# EasyEDA Pro project NAND-7S.eprj, schematic Schematic1
Board Name: Board1; Create Date: 2026-02-24; Page Name: P1; Project Name: NAND-7S; Schematic Name: Schematic1; Update Date: 2026-03-22; Company: 嘉立创EDA; Page Size: A4; Version: V1.0
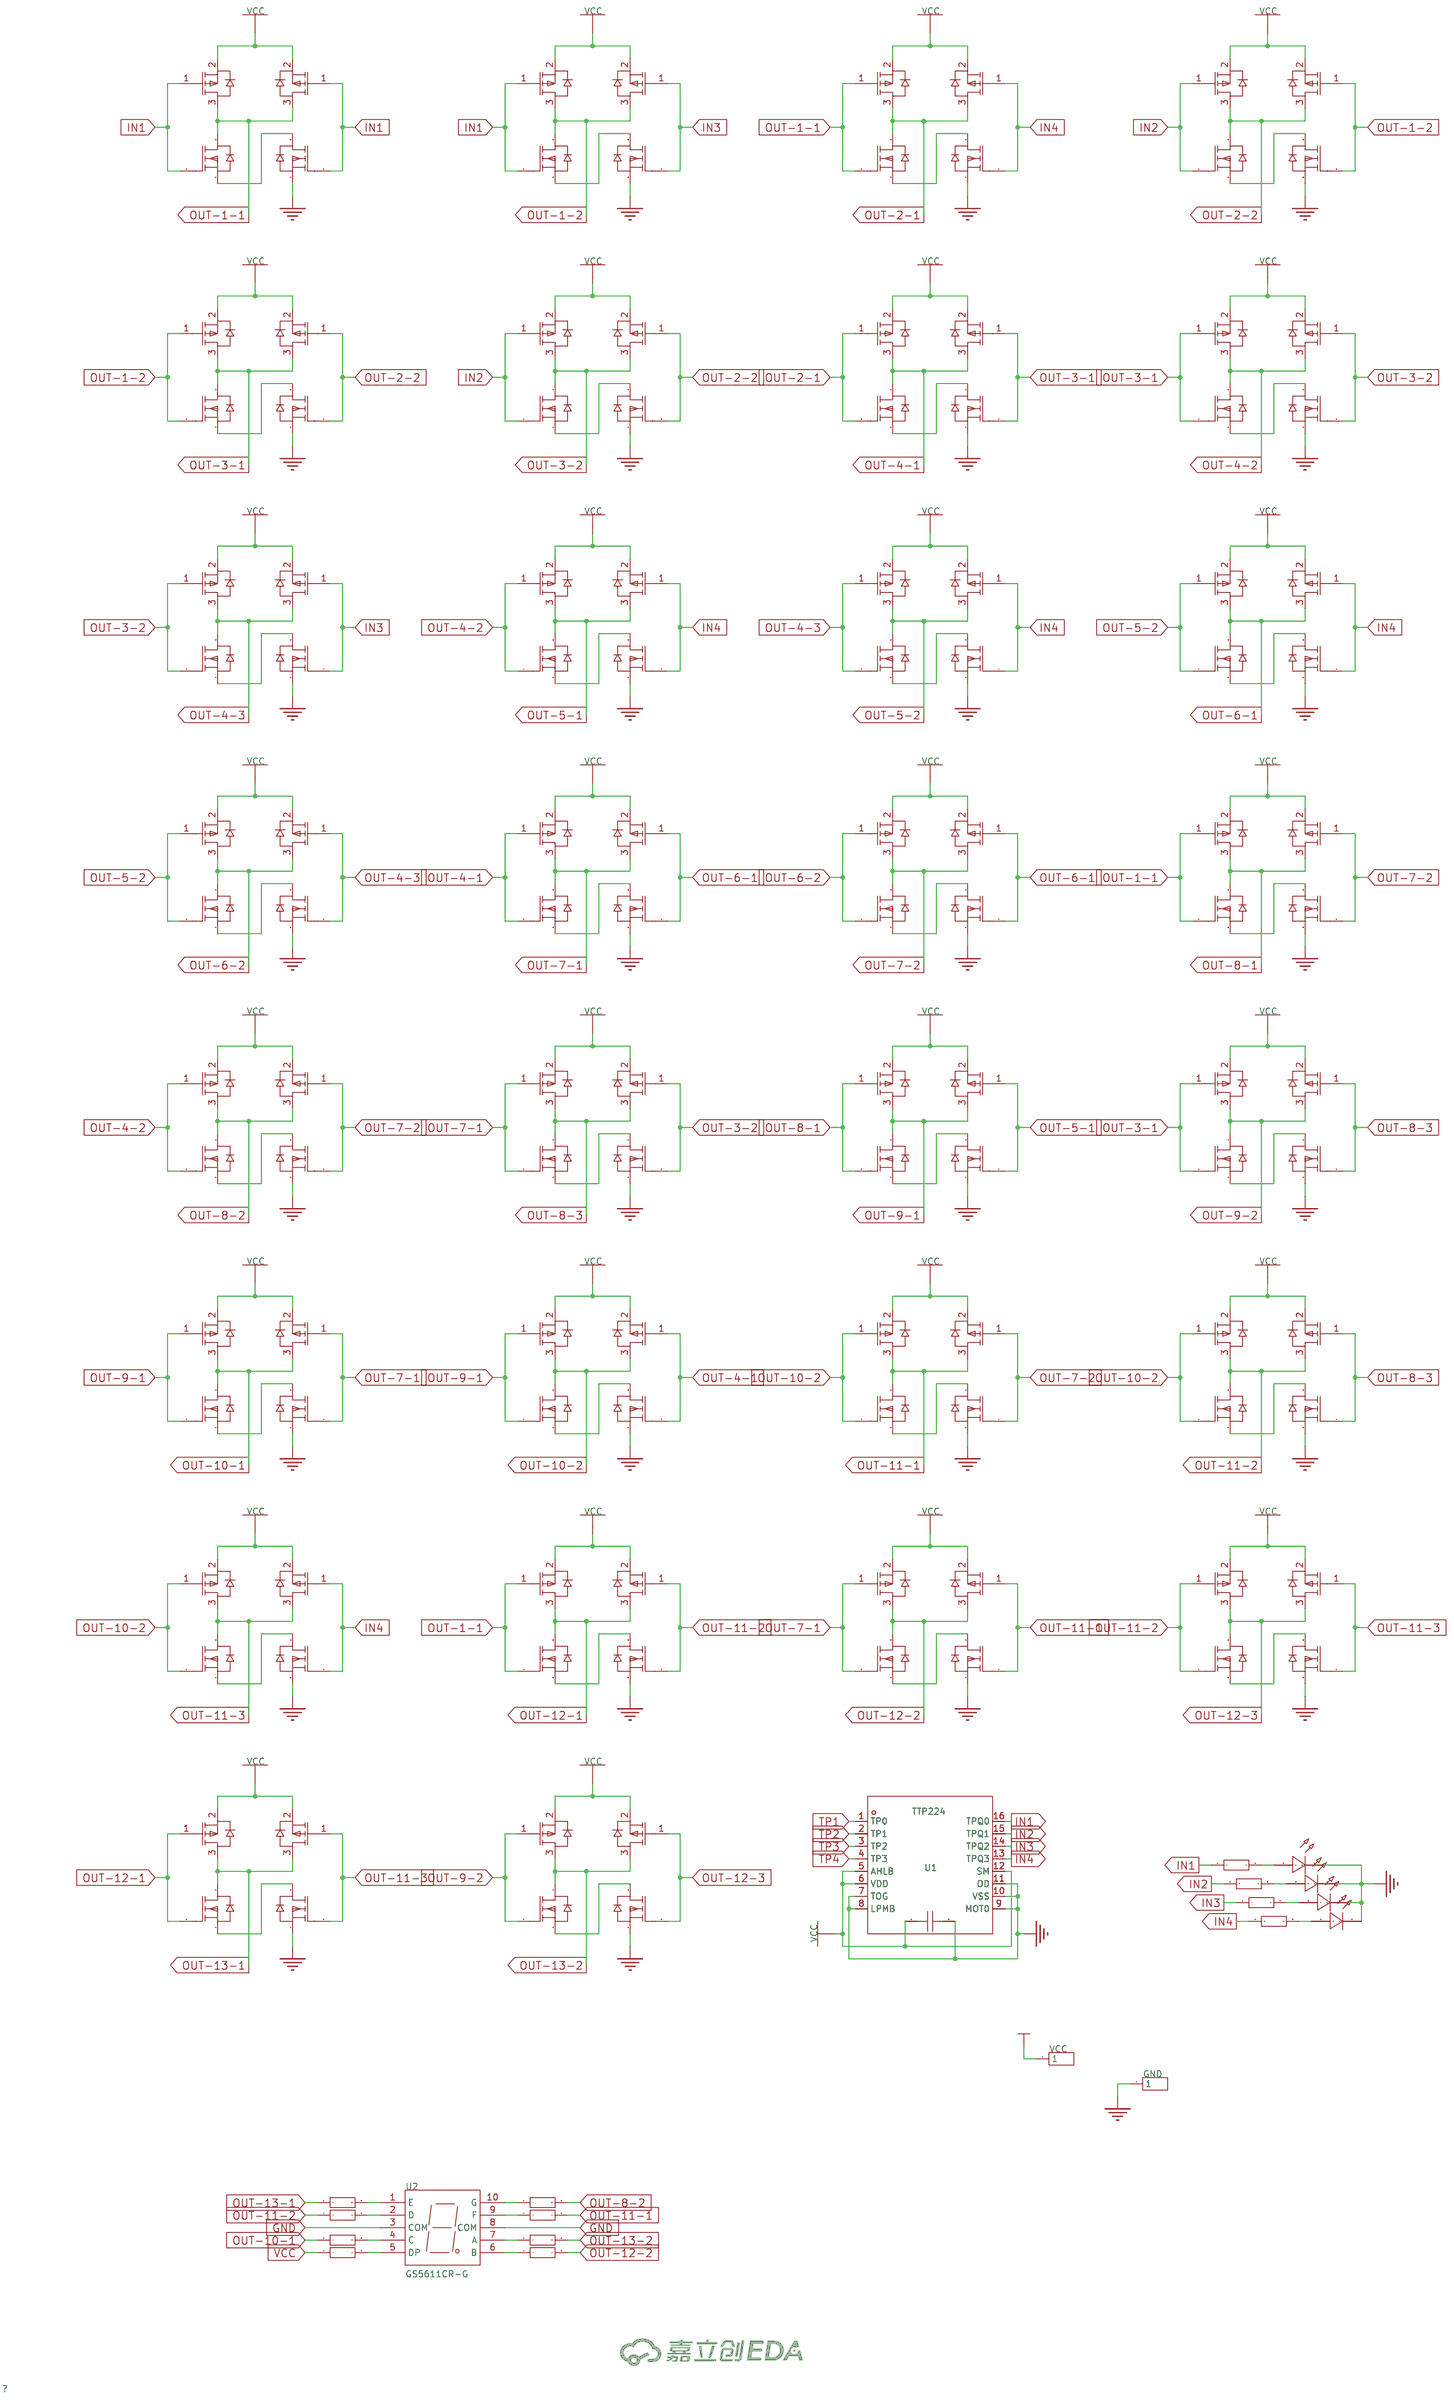
[diagram p0: schematic sheet]

## Parts
C1  100nF  [C0603]
GND  GND  [HDR-TH_1P-V-M_XKB_X4611WV-01I-C28D40]
LED1  -  [LED_0603]
LED2  -  [LED_0603]
LED3  -  [LED_0603]
LED4  -  [LED_0603]
N1-1  CJ2304  [SOT-23-3_L2.9-W1.3-P1.90-LS2.4-BR]
N1-2  CJ2304  [SOT-23-3_L2.9-W1.3-P1.90-LS2.4-BR]
N2-1  CJ2304  [SOT-23-3_L2.9-W1.3-P1.90-LS2.4-BR]
N2-2  CJ2304  [SOT-23-3_L2.9-W1.3-P1.90-LS2.4-BR]
N3-1  CJ2304  [SOT-23-3_L2.9-W1.3-P1.90-LS2.4-BR]
N3-2  CJ2304  [SOT-23-3_L2.9-W1.3-P1.90-LS2.4-BR]
N4-1  CJ2304  [SOT-23-3_L2.9-W1.3-P1.90-LS2.4-BR]
N4-2  CJ2304  [SOT-23-3_L2.9-W1.3-P1.90-LS2.4-BR]
N5-1  CJ2304  [SOT-23-3_L2.9-W1.3-P1.90-LS2.4-BR]
N5-2  CJ2304  [SOT-23-3_L2.9-W1.3-P1.90-LS2.4-BR]
N6-1  CJ2304  [SOT-23-3_L2.9-W1.3-P1.90-LS2.4-BR]
N6-2  CJ2304  [SOT-23-3_L2.9-W1.3-P1.90-LS2.4-BR]
N7-1  CJ2304  [SOT-23-3_L2.9-W1.3-P1.90-LS2.4-BR]
N7-2  CJ2304  [SOT-23-3_L2.9-W1.3-P1.90-LS2.4-BR]
N8-1  CJ2304  [SOT-23-3_L2.9-W1.3-P1.90-LS2.4-BR]
N8-2  CJ2304  [SOT-23-3_L2.9-W1.3-P1.90-LS2.4-BR]
N9-1  CJ2304  [SOT-23-3_L2.9-W1.3-P1.90-LS2.4-BR]
N9-2  CJ2304  [SOT-23-3_L2.9-W1.3-P1.90-LS2.4-BR]
N10-1  CJ2304  [SOT-23-3_L2.9-W1.3-P1.90-LS2.4-BR]
N10-2  CJ2304  [SOT-23-3_L2.9-W1.3-P1.90-LS2.4-BR]
N11-1  CJ2304  [SOT-23-3_L2.9-W1.3-P1.90-LS2.4-BR]
N11-2  CJ2304  [SOT-23-3_L2.9-W1.3-P1.90-LS2.4-BR]
N12-1  CJ2304  [SOT-23-3_L2.9-W1.3-P1.90-LS2.4-BR]
N12-2  CJ2304  [SOT-23-3_L2.9-W1.3-P1.90-LS2.4-BR]
N13-1  CJ2304  [SOT-23-3_L2.9-W1.3-P1.90-LS2.4-BR]
N13-2  CJ2304  [SOT-23-3_L2.9-W1.3-P1.90-LS2.4-BR]
N14-1  CJ2304  [SOT-23-3_L2.9-W1.3-P1.90-LS2.4-BR]
N14-2  CJ2304  [SOT-23-3_L2.9-W1.3-P1.90-LS2.4-BR]
N15-1  CJ2304  [SOT-23-3_L2.9-W1.3-P1.90-LS2.4-BR]
N15-2  CJ2304  [SOT-23-3_L2.9-W1.3-P1.90-LS2.4-BR]
N16-1  CJ2304  [SOT-23-3_L2.9-W1.3-P1.90-LS2.4-BR]
N16-2  CJ2304  [SOT-23-3_L2.9-W1.3-P1.90-LS2.4-BR]
N17-1  CJ2304  [SOT-23-3_L2.9-W1.3-P1.90-LS2.4-BR]
N17-2  CJ2304  [SOT-23-3_L2.9-W1.3-P1.90-LS2.4-BR]
N18-1  CJ2304  [SOT-23-3_L2.9-W1.3-P1.90-LS2.4-BR]
N18-2  CJ2304  [SOT-23-3_L2.9-W1.3-P1.90-LS2.4-BR]
N19-1  CJ2304  [SOT-23-3_L2.9-W1.3-P1.90-LS2.4-BR]
N19-2  CJ2304  [SOT-23-3_L2.9-W1.3-P1.90-LS2.4-BR]
N20-1  CJ2304  [SOT-23-3_L2.9-W1.3-P1.90-LS2.4-BR]
N20-2  CJ2304  [SOT-23-3_L2.9-W1.3-P1.90-LS2.4-BR]
N21-1  CJ2304  [SOT-23-3_L2.9-W1.3-P1.90-LS2.4-BR]
N21-2  CJ2304  [SOT-23-3_L2.9-W1.3-P1.90-LS2.4-BR]
N22-1  CJ2304  [SOT-23-3_L2.9-W1.3-P1.90-LS2.4-BR]
N22-2  CJ2304  [SOT-23-3_L2.9-W1.3-P1.90-LS2.4-BR]
N23-1  CJ2304  [SOT-23-3_L2.9-W1.3-P1.90-LS2.4-BR]
N23-2  CJ2304  [SOT-23-3_L2.9-W1.3-P1.90-LS2.4-BR]
N24-1  CJ2304  [SOT-23-3_L2.9-W1.3-P1.90-LS2.4-BR]
N24-2  CJ2304  [SOT-23-3_L2.9-W1.3-P1.90-LS2.4-BR]
N25-1  CJ2304  [SOT-23-3_L2.9-W1.3-P1.90-LS2.4-BR]
N25-2  CJ2304  [SOT-23-3_L2.9-W1.3-P1.90-LS2.4-BR]
N26-1  CJ2304  [SOT-23-3_L2.9-W1.3-P1.90-LS2.4-BR]
N26-2  CJ2304  [SOT-23-3_L2.9-W1.3-P1.90-LS2.4-BR]
N27-1  CJ2304  [SOT-23-3_L2.9-W1.3-P1.90-LS2.4-BR]
N27-2  CJ2304  [SOT-23-3_L2.9-W1.3-P1.90-LS2.4-BR]
N28-1  CJ2304  [SOT-23-3_L2.9-W1.3-P1.90-LS2.4-BR]
N28-2  CJ2304  [SOT-23-3_L2.9-W1.3-P1.90-LS2.4-BR]
N29-1  CJ2304  [SOT-23-3_L2.9-W1.3-P1.90-LS2.4-BR]
N29-2  CJ2304  [SOT-23-3_L2.9-W1.3-P1.90-LS2.4-BR]
N30-1  CJ2304  [SOT-23-3_L2.9-W1.3-P1.90-LS2.4-BR]
N30-2  CJ2304  [SOT-23-3_L2.9-W1.3-P1.90-LS2.4-BR]
P1-1  LP2301LT1G  [SOT-23-3_L2.9-W1.3-P1.90-LS2.4-BR]
P1-2  LP2301LT1G  [SOT-23-3_L2.9-W1.3-P1.90-LS2.4-BR]
P2-1  LP2301LT1G  [SOT-23-3_L2.9-W1.3-P1.90-LS2.4-BR]
P2-2  LP2301LT1G  [SOT-23-3_L2.9-W1.3-P1.90-LS2.4-BR]
P3-1  LP2301LT1G  [SOT-23-3_L2.9-W1.3-P1.90-LS2.4-BR]
P3-2  LP2301LT1G  [SOT-23-3_L2.9-W1.3-P1.90-LS2.4-BR]
P4-1  LP2301LT1G  [SOT-23-3_L2.9-W1.3-P1.90-LS2.4-BR]
P4-2  LP2301LT1G  [SOT-23-3_L2.9-W1.3-P1.90-LS2.4-BR]
P5-1  LP2301LT1G  [SOT-23-3_L2.9-W1.3-P1.90-LS2.4-BR]
P5-2  LP2301LT1G  [SOT-23-3_L2.9-W1.3-P1.90-LS2.4-BR]
P6-1  LP2301LT1G  [SOT-23-3_L2.9-W1.3-P1.90-LS2.4-BR]
P6-2  LP2301LT1G  [SOT-23-3_L2.9-W1.3-P1.90-LS2.4-BR]
P7-1  LP2301LT1G  [SOT-23-3_L2.9-W1.3-P1.90-LS2.4-BR]
P7-2  LP2301LT1G  [SOT-23-3_L2.9-W1.3-P1.90-LS2.4-BR]
P8-1  LP2301LT1G  [SOT-23-3_L2.9-W1.3-P1.90-LS2.4-BR]
P8-2  LP2301LT1G  [SOT-23-3_L2.9-W1.3-P1.90-LS2.4-BR]
P9-1  LP2301LT1G  [SOT-23-3_L2.9-W1.3-P1.90-LS2.4-BR]
P9-2  LP2301LT1G  [SOT-23-3_L2.9-W1.3-P1.90-LS2.4-BR]
P10-1  LP2301LT1G  [SOT-23-3_L2.9-W1.3-P1.90-LS2.4-BR]
P10-2  LP2301LT1G  [SOT-23-3_L2.9-W1.3-P1.90-LS2.4-BR]
P11-1  LP2301LT1G  [SOT-23-3_L2.9-W1.3-P1.90-LS2.4-BR]
P11-2  LP2301LT1G  [SOT-23-3_L2.9-W1.3-P1.90-LS2.4-BR]
P12-1  LP2301LT1G  [SOT-23-3_L2.9-W1.3-P1.90-LS2.4-BR]
P12-2  LP2301LT1G  [SOT-23-3_L2.9-W1.3-P1.90-LS2.4-BR]
P13-1  LP2301LT1G  [SOT-23-3_L2.9-W1.3-P1.90-LS2.4-BR]
P13-2  LP2301LT1G  [SOT-23-3_L2.9-W1.3-P1.90-LS2.4-BR]
P14-1  LP2301LT1G  [SOT-23-3_L2.9-W1.3-P1.90-LS2.4-BR]
P14-2  LP2301LT1G  [SOT-23-3_L2.9-W1.3-P1.90-LS2.4-BR]
P15-1  LP2301LT1G  [SOT-23-3_L2.9-W1.3-P1.90-LS2.4-BR]
P15-2  LP2301LT1G  [SOT-23-3_L2.9-W1.3-P1.90-LS2.4-BR]
P16-1  LP2301LT1G  [SOT-23-3_L2.9-W1.3-P1.90-LS2.4-BR]
P16-2  LP2301LT1G  [SOT-23-3_L2.9-W1.3-P1.90-LS2.4-BR]
P17-1  LP2301LT1G  [SOT-23-3_L2.9-W1.3-P1.90-LS2.4-BR]
P17-2  LP2301LT1G  [SOT-23-3_L2.9-W1.3-P1.90-LS2.4-BR]
P18-1  LP2301LT1G  [SOT-23-3_L2.9-W1.3-P1.90-LS2.4-BR]
P18-2  LP2301LT1G  [SOT-23-3_L2.9-W1.3-P1.90-LS2.4-BR]
P19-1  LP2301LT1G  [SOT-23-3_L2.9-W1.3-P1.90-LS2.4-BR]
P19-2  LP2301LT1G  [SOT-23-3_L2.9-W1.3-P1.90-LS2.4-BR]
P20-1  LP2301LT1G  [SOT-23-3_L2.9-W1.3-P1.90-LS2.4-BR]
P20-2  LP2301LT1G  [SOT-23-3_L2.9-W1.3-P1.90-LS2.4-BR]
P21-1  LP2301LT1G  [SOT-23-3_L2.9-W1.3-P1.90-LS2.4-BR]
P21-2  LP2301LT1G  [SOT-23-3_L2.9-W1.3-P1.90-LS2.4-BR]
P22-1  LP2301LT1G  [SOT-23-3_L2.9-W1.3-P1.90-LS2.4-BR]
P22-2  LP2301LT1G  [SOT-23-3_L2.9-W1.3-P1.90-LS2.4-BR]
P23-1  LP2301LT1G  [SOT-23-3_L2.9-W1.3-P1.90-LS2.4-BR]
P23-2  LP2301LT1G  [SOT-23-3_L2.9-W1.3-P1.90-LS2.4-BR]
P24-1  LP2301LT1G  [SOT-23-3_L2.9-W1.3-P1.90-LS2.4-BR]
P24-2  LP2301LT1G  [SOT-23-3_L2.9-W1.3-P1.90-LS2.4-BR]
P25-1  LP2301LT1G  [SOT-23-3_L2.9-W1.3-P1.90-LS2.4-BR]
P25-2  LP2301LT1G  [SOT-23-3_L2.9-W1.3-P1.90-LS2.4-BR]
P26-1  LP2301LT1G  [SOT-23-3_L2.9-W1.3-P1.90-LS2.4-BR]
P26-2  LP2301LT1G  [SOT-23-3_L2.9-W1.3-P1.90-LS2.4-BR]
P27-1  LP2301LT1G  [SOT-23-3_L2.9-W1.3-P1.90-LS2.4-BR]
P27-2  LP2301LT1G  [SOT-23-3_L2.9-W1.3-P1.90-LS2.4-BR]
P28-1  LP2301LT1G  [SOT-23-3_L2.9-W1.3-P1.90-LS2.4-BR]
P28-2  LP2301LT1G  [SOT-23-3_L2.9-W1.3-P1.90-LS2.4-BR]
P29-1  LP2301LT1G  [SOT-23-3_L2.9-W1.3-P1.90-LS2.4-BR]
P29-2  LP2301LT1G  [SOT-23-3_L2.9-W1.3-P1.90-LS2.4-BR]
P30-1  LP2301LT1G  [SOT-23-3_L2.9-W1.3-P1.90-LS2.4-BR]
P30-2  LP2301LT1G  [SOT-23-3_L2.9-W1.3-P1.90-LS2.4-BR]
R1  470  [R0603]
R2  470  [R0603]
R3  470  [R0603]
R4  470  [R0603]
R5  470  [R0603]
R6  470  [R0603]
R8  470  [R0603]
R9  470  [R0603]
R10  470  [R0603]
R11  470  [R0603]
R13  470  [R0603]
R14  470  [R0603]
U1  TTP224  [TSSOP-16_L5.0-W4.4-P0.65-LS6.4-BL]
U2  GS5611CR-G  [LED-SEG-SMD_GS5611CR-G]
VCC  VCC  [HDR-TH_1P-V-M_XKB_X4611WV-01I-C28D40]

## Library data of the parts
C1 = CAP_0603: Supplier Footprint: 0603
GND VCC = HDR-M_2.54_1x1P: Supplier Part: C81276; Supplier Footprint: 插件; JLCPCB Part Class: Extended Part
LED1-LED4 = LED_0603-R: Supplier Footprint: 0603
N1-1 N1-2 N2-1 N2-2 N3-1 N3-2 N4-1 N4-2 N5-1 N5-2 N6-1 N6-2 N7-1 N7-2 N8-1 N8-2 N9-1 N9-2 N10-1 N10-2 N11-1 N11-2 N12-1 N12-2 N13-1 N13-2 N14-1 N14-2 N15-1 N15-2 N16-1 N16-2 N17-1 N17-2 N18-1 N18-2 N19-1 N19-2 N20-1 N20-2 N21-1 N21-2 N22-1 N22-2 N23-1 N23-2 N24-1 N24-2 N25-1 N25-2 N26-1 N26-2 N27-1 N27-2 N28-1 N28-2 N29-1 N29-2 N30-1 N30-2 = CJ2304_C44209: LCSC Part Name: N沟道 30V 3.3A; Supplier Part: C44209; Manufacturer: CJ（江苏长电/长晶）; Supplier Footprint: SOT-23(SOT-23-3); JLCPCB Part Class: Extended Part; Datasheet: https://atta.szlcsc.com/upload/public/pdf/source/20150407/1457707272847.pdf; Supplier: LCSC; Type: N沟道; Drain Source Voltage (Vdss): 30V; Continuous Drain Current (Id): 3.3A; Power Dissipation (Pd): 350mW; Drain Source On Resistance (RDS(on)@Vgs,Id): 60mΩ@10V,3.2A; Gate Threshold Voltage (Vgs(th)@Id): 2.2V@250μA
P1-1 P1-2 P2-1 P2-2 P3-1 P3-2 P4-1 P4-2 P5-1 P5-2 P6-1 P6-2 P7-1 P7-2 P8-1 P8-2 P9-1 P9-2 P10-1 P10-2 P11-1 P11-2 P12-1 P12-2 P13-1 P13-2 P14-1 P14-2 P15-1 P15-2 P16-1 P16-2 P17-1 P17-2 P18-1 P18-2 P19-1 P19-2 P20-1 P20-2 P21-1 P21-2 P22-1 P22-2 P23-1 P23-2 P24-1 P24-2 P25-1 P25-2 P26-1 P26-2 P27-1 P27-2 P28-1 P28-2 P29-1 P29-2 P30-1 P30-2 = LP2301LT1G: LCSC Part Name: P沟道 20V 2.3A; Supplier Part: C77937; Manufacturer: LRC(乐山无线电); Supplier Footprint: SOT-23(SOT-23-3); JLCPCB Part Class: Extended Part; Datasheet: https://atta.szlcsc.com/upload/public/pdf/source/20160706/1467801115774.pdf; Supplier: LCSC; Type: P沟道; Drain Source Voltage (Vdss): 20V; Continuous Drain Current (Id): 2.3A; Power Dissipation (Pd): 900mW; Drain Source On Resistance (RDS(on)@Vgs,Id): 100mΩ@4.5V,2.8A; Gate Threshold Voltage (Vgs(th)@Id): 900mV@250μA
R1-R6 R8-R11 R13 R14 = Res_0603: Supplier Footprint: 0603
U1 = TTP224B-BSBN: LCSC Part Name: TTP224B-BSBN 表面无字 无丝印; Supplier Part: C94149; Manufacturer: TONTEK(台湾通泰); Supplier Footprint: SSOP-16_150mil; JLCPCB Part Class: Extended Part; Datasheet: https://atta.szlcsc.com/upload/public/pdf/source/20170120/1484891310087.pdf; Supplier: LCSC
U2 = GS5611CR-G: LCSC Part Name: LED贴片数码管; Supplier Part: C22462697; Manufacturer: Guangcai Display(光彩显示); Supplier Footprint: SMD,19x12.4mm; JLCPCB Part Class: 扩展库; Datasheet: https://atta.szlcsc.com/upload/public/pdf/source/20240611/A29D0834A44E59B26FE2D23CAA8611A5.pdf; Supplier: LCSC

## Nets
GND: C1.2 GND.1 LED1.1(C) LED2.1(C) LED3.1(C) LED4.1(C) N1-2.2(S) N2-2.2(S) N3-2.2(S) N4-2.2(S) N5-2.2(S) N6-2.2(S) N7-2.2(S) N8-2.2(S) N9-2.2(S) N10-2.2(S) N11-2.2(S) N12-2.2(S) N13-2.2(S) N14-2.2(S) N15-2.2(S) N16-2.2(S) N17-2.2(S) N18-2.2(S) N19-2.2(S) N20-2.2(S) N21-2.2(S) N22-2.2(S) N23-2.2(S) N24-2.2(S) N25-2.2(S) N26-2.2(S) N27-2.2(S) N28-2.2(S) N29-2.2(S) N30-2.2(S) U1.7(TOG) U1.8(LPMB) U1.9(MOT0) U1.10(VSS) U1.11(OD) U2.3(COM) U2.8(COM)
VCC: C1.1 P1-1.2(S) P1-2.2(S) P2-1.2(S) P2-2.2(S) P3-1.2(S) P3-2.2(S) P4-1.2(S) P4-2.2(S) P5-1.2(S) P5-2.2(S) P6-1.2(S) P6-2.2(S) P7-1.2(S) P7-2.2(S) P8-1.2(S) P8-2.2(S) P9-1.2(S) P9-2.2(S) P10-1.2(S) P10-2.2(S) P11-1.2(S) P11-2.2(S) P12-1.2(S) P12-2.2(S) P13-1.2(S) P13-2.2(S) P14-1.2(S) P14-2.2(S) P15-1.2(S) P15-2.2(S) P16-1.2(S) P16-2.2(S) P17-1.2(S) P17-2.2(S) P18-1.2(S) P18-2.2(S) P19-1.2(S) P19-2.2(S) P20-1.2(S) P20-2.2(S) P21-1.2(S) P21-2.2(S) P22-1.2(S) P22-2.2(S) P23-1.2(S) P23-2.2(S) P24-1.2(S) P24-2.2(S) P25-1.2(S) P25-2.2(S) P26-1.2(S) P26-2.2(S) P27-1.2(S) P27-2.2(S) P28-1.2(S) P28-2.2(S) P29-1.2(S) P29-2.2(S) P30-1.2(S) P30-2.2(S) R9.1 U1.5(AHLB) U1.6(VDD) U1.12(SM) VCC.1
A: R11.1 U2.7(A)
B: R10.1 U2.6(B)
C: R8.2 U2.4(C)
D: R6.2 U2.2(D)
E: R5.2 U2.1(E)
F: R13.1 U2.9(F)
G: R14.1 U2.10(G)
IN1: N1-1.1(G) N1-2.1(G) N2-1.1(G) P1-1.1(G) P1-2.1(G) P2-1.1(G) R1.1 U1.16(TPQ0)
IN2: N4-1.1(G) N6-1.1(G) P4-1.1(G) P6-1.1(G) R2.1 U1.15(TPQ1)
IN3: N2-2.1(G) N9-2.1(G) P2-2.1(G) P9-2.1(G) R3.1 U1.14(TPQ2)
IN4: N3-2.1(G) N10-2.1(G) N11-2.1(G) N12-2.1(G) N25-2.1(G) P3-2.1(G) P10-2.1(G) P11-2.1(G) P12-2.1(G) P25-2.1(G) R4.1 U1.13(TPQ3)
LED1: LED1.2(A) R1.2
LED2: LED2.2(A) R2.2
LED3: LED3.2(A) R3.2
LED4: LED4.2(A) R4.2
NAND1: N1-1.2(S) N1-2.3(D)
NAND2: N2-1.2(S) N2-2.3(D)
NAND3: N3-1.2(S) N3-2.3(D)
NAND4: N4-1.2(S) N4-2.3(D)
NAND5: N5-1.2(S) N5-2.3(D)
NAND6: N6-1.2(S) N6-2.3(D)
NAND7: N7-1.2(S) N7-2.3(D)
NAND8: N8-1.2(S) N8-2.3(D)
NAND9: N9-1.2(S) N9-2.3(D)
NAND10: N10-1.2(S) N10-2.3(D)
NAND11: N11-1.2(S) N11-2.3(D)
NAND12: N12-1.2(S) N12-2.3(D)
NAND13: N13-1.2(S) N13-2.3(D)
NAND14: N14-1.2(S) N14-2.3(D)
NAND15: N15-1.2(S) N15-2.3(D)
NAND16: N16-1.2(S) N16-2.3(D)
NAND17: N17-1.2(S) N17-2.3(D)
NAND18: N18-1.2(S) N18-2.3(D)
NAND19: N19-1.2(S) N19-2.3(D)
NAND20: N20-1.2(S) N20-2.3(D)
NAND21: N21-1.2(S) N21-2.3(D)
NAND22: N22-1.2(S) N22-2.3(D)
NAND23: N23-1.2(S) N23-2.3(D)
NAND24: N24-1.2(S) N24-2.3(D)
NAND25: N25-1.2(S) N25-2.3(D)
NAND26: N26-1.2(S) N26-2.3(D)
NAND27: N27-1.2(S) N27-2.3(D)
NAND28: N28-1.2(S) N28-2.3(D)
NAND29: N29-1.2(S) N29-2.3(D)
NAND30: N30-1.2(S) N30-2.3(D)
OUT-1-1: N1-1.3(D) N3-1.1(G) N16-1.1(G) N26-1.1(G) P1-1.3(D) P1-2.3(D) P3-1.1(G) P16-1.1(G) P26-1.1(G)
OUT-1-2: N2-1.3(D) N4-2.1(G) N5-1.1(G) P2-1.3(D) P2-2.3(D) P4-2.1(G) P5-1.1(G)
OUT-2-1: N3-1.3(D) N7-1.1(G) P3-1.3(D) P3-2.3(D) P7-1.1(G)
OUT-2-2: N4-1.3(D) N5-2.1(G) N6-2.1(G) P4-1.3(D) P4-2.3(D) P5-2.1(G) P6-2.1(G)
OUT-3-1: N5-1.3(D) N7-2.1(G) N8-1.1(G) N20-1.1(G) P5-1.3(D) P5-2.3(D) P7-2.1(G) P8-1.1(G) P20-1.1(G)
OUT-3-2: N6-1.3(D) N8-2.1(G) N9-1.1(G) N18-2.1(G) P6-1.3(D) P6-2.3(D) P8-2.1(G) P9-1.1(G) P18-2.1(G)
OUT-4-1: N7-1.3(D) N14-1.1(G) N22-2.1(G) P7-1.3(D) P7-2.3(D) P14-1.1(G) P22-2.1(G)
OUT-4-2: N8-1.3(D) N10-1.1(G) N17-1.1(G) P8-1.3(D) P8-2.3(D) P10-1.1(G) P17-1.1(G)
OUT-4-3: N9-1.3(D) N11-1.1(G) N13-2.1(G) P9-1.3(D) P9-2.3(D) P11-1.1(G) P13-2.1(G)
OUT-5-1: N10-1.3(D) N19-2.1(G) P10-1.3(D) P10-2.3(D) P19-2.1(G)
OUT-5-2: N11-1.3(D) N12-1.1(G) N13-1.1(G) P11-1.3(D) P11-2.3(D) P12-1.1(G) P13-1.1(G)
OUT-6-1: N12-1.3(D) N14-2.1(G) N15-2.1(G) P12-1.3(D) P12-2.3(D) P14-2.1(G) P15-2.1(G)
OUT-6-2: N13-1.3(D) N15-1.1(G) P13-1.3(D) P13-2.3(D) P15-1.1(G)
OUT-7-1: N14-1.3(D) N18-1.1(G) N21-2.1(G) N27-1.1(G) P14-1.3(D) P14-2.3(D) P18-1.1(G) P21-2.1(G) P27-1.1(G)
OUT-7-2: N15-1.3(D) N16-2.1(G) N17-2.1(G) N23-2.1(G) P15-1.3(D) P15-2.3(D) P16-2.1(G) P17-2.1(G) P23-2.1(G)
OUT-8-1: N16-1.3(D) N19-1.1(G) P16-1.3(D) P16-2.3(D) P19-1.1(G)
OUT-8-2: N17-1.3(D) P17-1.3(D) P17-2.3(D) R14.2
OUT-8-3: N18-1.3(D) N20-2.1(G) N24-2.1(G) P18-1.3(D) P18-2.3(D) P20-2.1(G) P24-2.1(G)
OUT-9-1: N19-1.3(D) N21-1.1(G) N22-1.1(G) P19-1.3(D) P19-2.3(D) P21-1.1(G) P22-1.1(G)
OUT-9-2: N20-1.3(D) N30-1.1(G) P20-1.3(D) P20-2.3(D) P30-1.1(G)
OUT-10-1: N21-1.3(D) P21-1.3(D) P21-2.3(D) R8.1
OUT-10-2: N22-1.3(D) N23-1.1(G) N24-1.1(G) N25-1.1(G) P22-1.3(D) P22-2.3(D) P23-1.1(G) P24-1.1(G) P25-1.1(G)
OUT-11-1: N23-1.3(D) N27-2.1(G) P23-1.3(D) P23-2.3(D) P27-2.1(G) R13.2
OUT-11-2: N24-1.3(D) N26-2.1(G) N28-1.1(G) P24-1.3(D) P24-2.3(D) P26-2.1(G) P28-1.1(G) R6.1
OUT-11-3: N25-1.3(D) N28-2.1(G) N29-2.1(G) P25-1.3(D) P25-2.3(D) P28-2.1(G) P29-2.1(G)
OUT-12-1: N26-1.3(D) N29-1.1(G) P26-1.3(D) P26-2.3(D) P29-1.1(G)
OUT-12-2: N27-1.3(D) P27-1.3(D) P27-2.3(D) R10.2
OUT-12-3: N28-1.3(D) N30-2.1(G) P28-1.3(D) P28-2.3(D) P30-2.1(G)
OUT-13-1: N29-1.3(D) P29-1.3(D) P29-2.3(D) R5.1
OUT-13-2: N30-1.3(D) P30-1.3(D) P30-2.3(D) R11.2
P: R9.2 U2.5(DP)
TP1: U1.1(TP0)
TP2: U1.2(TP1)
TP3: U1.3(TP2)
TP4: U1.4(TP3)
